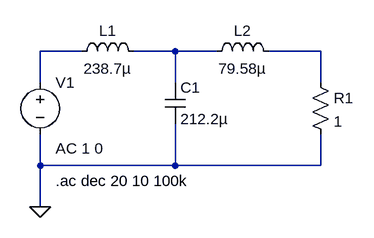
[diagram p0: schematic LPF.asc]
LPF.asc, the LTspice schematic file:
Version 4
SHEET 1 880 680
WIRE 192 256 128 256
WIRE 336 256 272 256
WIRE 400 256 336 256
WIRE 560 256 480 256
WIRE 128 304 128 256
WIRE 336 304 336 256
WIRE 560 304 560 256
WIRE 128 432 128 384
WIRE 336 432 336 368
WIRE 336 432 128 432
WIRE 560 432 560 384
WIRE 560 432 336 432
WIRE 128 496 128 432
FLAG 128 496 0
SYMBOL ind 176 272 R270
WINDOW 0 32 56 VTop 2
WINDOW 3 5 56 VBottom 2
SYMATTR InstName L1
SYMATTR Value 238.7µ
SYMBOL ind 384 272 R270
WINDOW 0 32 56 VTop 2
WINDOW 3 5 56 VBottom 2
SYMATTR InstName L2
SYMATTR Value 79.58µ
SYMBOL res 544 288 R0
SYMATTR InstName R1
SYMATTR Value 1
SYMBOL cap 320 304 R0
SYMATTR InstName C1
SYMATTR Value 212.2µ
SYMBOL voltage 128 288 R0
WINDOW 123 24 118 Left 2
SYMATTR InstName V1
SYMATTR Value ""
SYMATTR Value2 AC 1 0
TEXT 152 456 Left 2 !.ac dec 20 10 100k

The netlist it stands for:
* LPF.asc
L1 N001 N002 238.7µ
L2 N002 N003 79.58µ
R1 N003 0 1
C1 N002 0 212.2µ
V1 N001 0 AC 1 0
.ac dec 20 10 100k
.backanno
.end